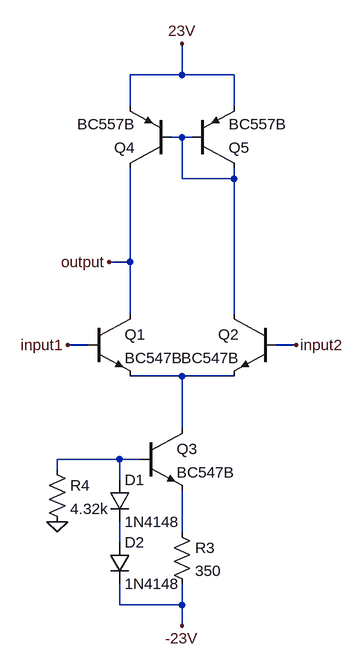
[diagram p0: schematic Draft3.asc]
Draft3.asc, the LTspice schematic file:
Version 4
SHEET 1 880 680
WIRE -48 -544 -48 -592
WIRE -48 -544 -128 -544
WIRE 32 -544 -48 -544
WIRE -128 -496 -128 -544
WIRE 32 -496 32 -544
WIRE -48 -448 -64 -448
WIRE -32 -448 -48 -448
WIRE -48 -384 -48 -448
WIRE 32 -384 32 -400
WIRE 32 -384 -48 -384
WIRE -128 -256 -128 -400
WIRE -128 -256 -160 -256
WIRE -128 -176 -128 -256
WIRE 32 -176 32 -384
WIRE -192 -128 -224 -128
WIRE 128 -128 96 -128
WIRE -48 -80 -128 -80
WIRE 32 -80 -48 -80
WIRE -48 0 -48 -80
WIRE -144 48 -240 48
WIRE -112 48 -144 48
WIRE -240 64 -240 48
WIRE -144 80 -144 48
WIRE -48 160 -48 96
WIRE -144 176 -144 144
WIRE -144 272 -144 240
WIRE -48 272 -48 240
WIRE -48 272 -144 272
WIRE -48 304 -48 272
FLAG -240 144 0
FLAG -224 -128 input1
FLAG 128 -128 input2
FLAG -48 -592 23V
FLAG -48 304 -23V
FLAG -160 -256 output
SYMBOL res -64 144 R0
SYMATTR InstName R3
SYMATTR Value 350
SYMBOL res -256 48 R0
SYMATTR InstName R4
SYMATTR Value 4.32k
SYMBOL npn -192 -176 R0
SYMATTR InstName Q1
SYMATTR Value BC547B
SYMBOL npn 96 -176 M0
SYMATTR InstName Q2
SYMATTR Value BC547B
SYMBOL pnp -64 -400 R180
SYMATTR InstName Q4
SYMATTR Value BC557B
SYMBOL pnp -32 -400 M180
SYMATTR InstName Q5
SYMATTR Value BC557B
SYMBOL diode -160 80 R0
SYMATTR InstName D1
SYMATTR Value 1N4148
SYMBOL diode -160 176 R0
SYMATTR InstName D2
SYMATTR Value 1N4148
SYMBOL npn -112 0 R0
SYMATTR InstName Q3
SYMATTR Value BC547B

The netlist it stands for:
* Draft3.asc
R3 N004 -23V 350
R4 N003 0 4.32k
Q1 output input1 N002 0 BC547B
Q2 N001 input2 N002 0 BC547B
Q4 output N001 23V 0 BC557B
Q5 N001 N001 23V 0 BC557B
D1 N003 N005 1N4148
D2 N005 -23V 1N4148
Q3 N002 N003 N004 0 BC547B
.model D D
.lib standard.dio
.model NPN NPN
.model PNP PNP
.lib standard.bjt
.backanno
.end